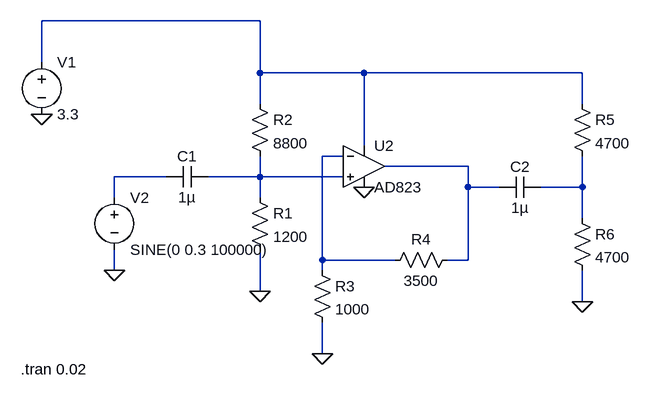
[diagram p0: schematic wurstradar.asc]
wurstradar.asc, the LTspice schematic file:
Version 4
SHEET 1 880 680
WIRE 32 -96 -304 -96
WIRE -304 -32 -304 -96
WIRE 32 -16 32 -96
WIRE 192 -16 32 -16
WIRE 528 -16 192 -16
WIRE 32 32 32 -16
WIRE 528 32 528 -16
WIRE 192 96 192 -16
WIRE 160 112 128 112
WIRE 352 128 224 128
WIRE -112 144 -192 144
WIRE 32 144 32 112
WIRE 32 144 -48 144
WIRE 160 144 32 144
WIRE 352 160 352 128
WIRE 400 160 352 160
WIRE 528 160 528 112
WIRE 528 160 464 160
WIRE -192 176 -192 144
WIRE 32 176 32 144
WIRE 528 208 528 160
WIRE 128 272 128 112
WIRE 240 272 128 272
WIRE 352 272 352 160
WIRE 352 272 320 272
WIRE -192 288 -192 256
WIRE 128 288 128 272
WIRE 32 320 32 256
WIRE 528 336 528 288
WIRE 128 416 128 368
FLAG 32 320 0
FLAG 128 416 0
FLAG 528 336 0
FLAG -304 48 0
FLAG -192 288 0
FLAG 192 160 0
SYMBOL cap -48 128 R90
WINDOW 0 0 32 VBottom 2
WINDOW 3 32 32 VTop 2
SYMATTR InstName C1
SYMATTR Value 1µ
SYMBOL res 16 160 R0
SYMATTR InstName R1
SYMATTR Value 1200
SYMBOL res 16 16 R0
SYMATTR InstName R2
SYMATTR Value 8800
SYMBOL res 112 272 R0
SYMATTR InstName R3
SYMATTR Value 1000
SYMBOL res 336 256 R90
WINDOW 0 0 56 VBottom 2
WINDOW 3 32 56 VTop 2
SYMATTR InstName R4
SYMATTR Value 3500
SYMBOL cap 464 144 R90
WINDOW 0 0 32 VBottom 2
WINDOW 3 32 32 VTop 2
SYMATTR InstName C2
SYMATTR Value 1µ
SYMBOL res 512 16 R0
SYMATTR InstName R5
SYMATTR Value 4700
SYMBOL res 512 192 R0
SYMATTR InstName R6
SYMATTR Value 4700
SYMBOL voltage -304 -48 R0
WINDOW 123 0 0 Left 2
WINDOW 39 0 0 Left 2
SYMATTR InstName V1
SYMATTR Value 3.3
SYMBOL voltage -192 160 R0
WINDOW 123 0 0 Left 2
WINDOW 39 0 0 Left 2
SYMATTR InstName V2
SYMATTR Value SINE(0 0.3 100000)
SYMBOL Opamps\\AD823 192 64 R0
SYMATTR InstName U2
TEXT -336 440 Left 2 !.tran 0.02

The netlist it stands for:
* wurstradar.asc
C1 N005 N004 1µ
R1 N005 0 1200
R2 N001 N005 8800
R3 N002 0 1000
R4 N003 N002 3500
C2 N006 N003 1µ
R5 N001 N006 4700
R6 N006 0 4700
V1 N001 0 3.3
V2 N004 0 SINE(0 0.3 100000)
XU2 N005 N002 N001 0 N003 AD823  ; pins In+ In- V+ V- OUT
.tran 0.02
.lib ADI.lib
.backanno
.end